# Altium schematic sheet 04-RS422-2.SchDoc
size A3
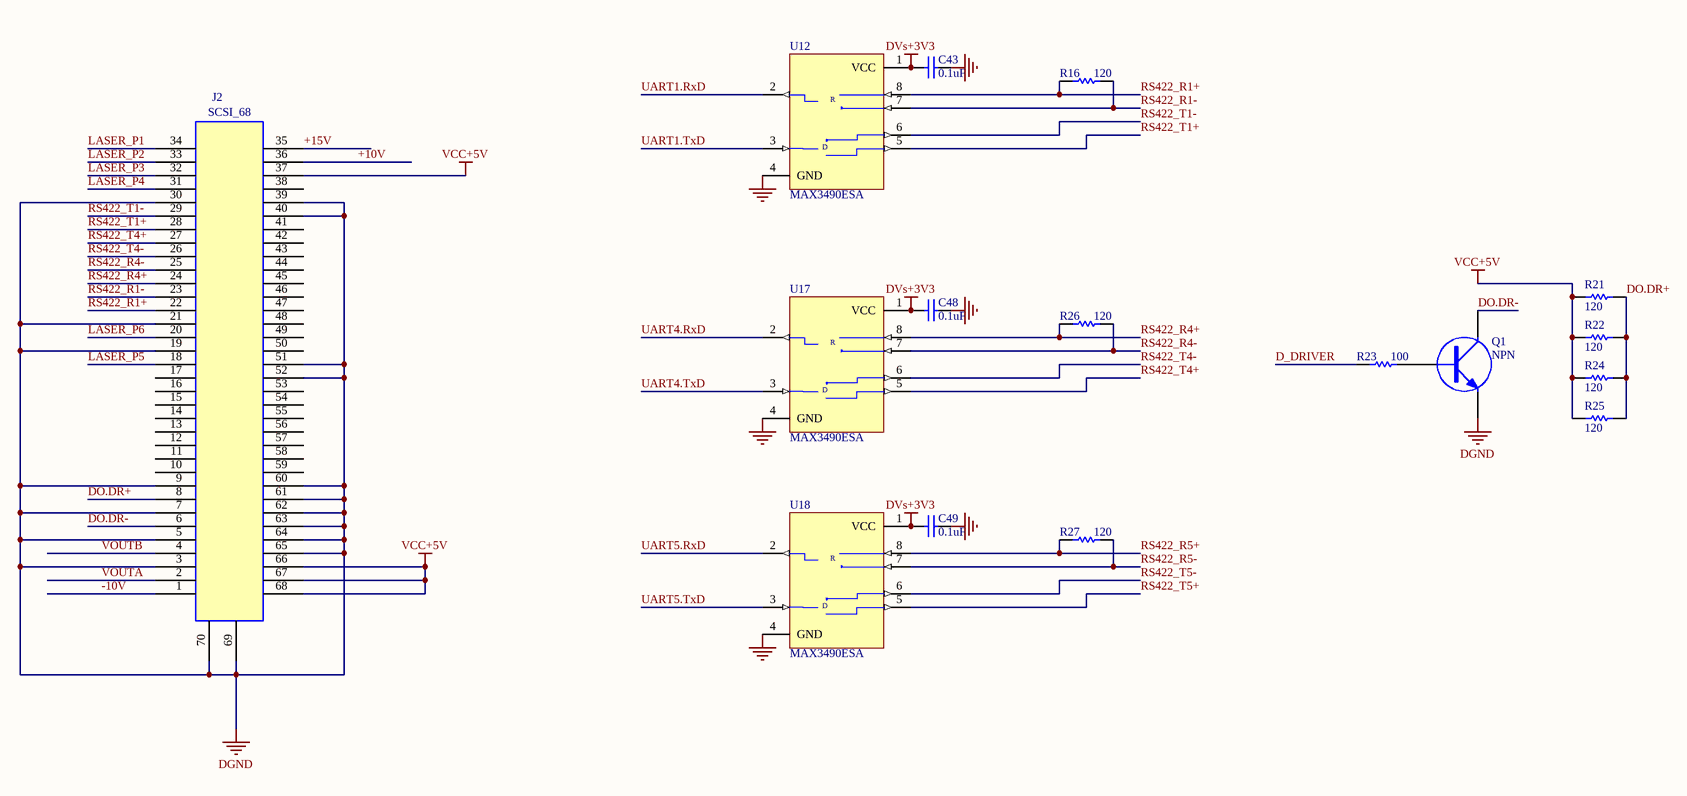
[diagram p0: 04-RS422-2.SchDoc]

## Parts
C43  0.1uF  [CR1608-0603]
C48  0.1uF  [CR1608-0603]
C49  0.1uF  [CR1608-0603]
J2  SCSI_68  [SCSI68]
Q1  NPN  [3DG130BJ_NPN]
R16  120  [CR3216-1206]
R21  120  [CR3216-1206]
R22  120  [CR3216-1206]
R23  100  [0805-X]
R24  120  [CR3216-1206]
R25  120  [CR3216-1206]
R26  120  [CR3216-1206]
R27  120  [CR3216-1206]
U12  MAX3490ESA  [SO8.W=6.0]
U17  MAX3490ESA  [SO8.W=6.0]
U18  MAX3490ESA  [SO8.W=6.0]

## Nets
DGND: C43.2 C48.2 C49.2 J2.3 J2.5 J2.7 J2.9 J2.19 J2.21 J2.30 J2.39 J2.40 J2.51 J2.52 J2.60 J2.61 J2.62 J2.63 J2.64 J2.65 J2.69 J2.70 Q1.3(E) U12.4(GND) U17.4(GND) U18.4(GND)
DVs+3V3: C43.1 C48.1 C49.1 U12.1(VCC) U17.1(VCC) U18.1(VCC)
VCC+5V: J2.37 J2.66 J2.67 J2.68 R21.1 R22.1 R24.1 R25.1
+10V: J2.36
+15V: J2.35
-10V: J2.1
D_DRIVER: R23.2
DO.DR+: J2.8 R21.2 R22.2 R24.2 R25.2
DO.DR-: J2.6 Q1.2(C)
LASER_P1: J2.34
LASER_P2: J2.33
LASER_P3: J2.32
LASER_P4: J2.31
LASER_P5: J2.18
LASER_P6: J2.20
RS422_R1+: J2.22 R16.2 U12.8(A)
RS422_R1-: J2.23 R16.1 U12.7(B)
RS422_R4+: J2.24 R26.2 U17.8(A)
RS422_R4-: J2.25 R26.1 U17.7(B)
RS422_R5+: R27.2 U18.8(A)
RS422_R5-: R27.1 U18.7(B)
RS422_T1+: J2.28 U12.5(Y)
RS422_T1-: J2.29 U12.6(Z)
RS422_T4+: J2.27 U17.5(Y)
RS422_T4-: J2.26 U17.6(Z)
RS422_T5+: U18.5(Y)
RS422_T5-: U18.6(Z)
UART1.RxD: U12.2(RO)
UART1.TxD: U12.3(DI)
UART4.RxD: U17.2(RO)
UART4.TxD: U17.3(DI)
UART5.RxD: U18.2(RO)
UART5.TxD: U18.3(DI)
VOUTA: J2.2
VOUTB: J2.4
NetQ1_1: Q1.1(B) R23.1

Not connected (* = marked no-connect by the designer): J2 10 11 12 13 14 15 16 17 38 41 42 43 44 45 46 47 48 49 50 53 54 55 56 57 58 59

## Notes on the sheet
- (in symbol MAX488ESA) R; D

## Library data of the parts
C43 C48 C49 = Cap: X7R; Published: 8-Jun-2000; LatestRevisionDate: 17-Jul-2002; LatestRevisionNote: Re-released for DXP Platform.; PackageReference: RAD-0.3; Publisher: Altium Limited; Value: 0.1uF
J2 = SCS
Q1 = NPN: NPN Transistor
R16 R21-R27 = Res1: Resistor; Published: 8-Jun-2000; LatestRevisionDate: 17-Jul-2002; LatestRevisionNote: Re-released for DXP Platform.; PackageReference: AXIAL-0.3; Publisher: Altium Limited
  R16 R21 R22 R24-R27: Value: 120
  R23: Value: 100
U12 U17 U18 = MAX488ESA: Low-Power, Slew-Rate-Limited RS-485/RS-422 Transceiver; Published: 16-Jan-2001; LatestRevisionDate: 13-Apr-2006; LatestRevisionNote: IPC-7351 Footprint Added.; DatasheetVersion: Feb-1996; PackageReference: NSO8; Publisher: Altium Limited; PackageDescription: 8-Pin Small Outline Integrated Circuit 1.27 mm Pitch; Code_JEDEC: MS-012-AA; Code_IPC: SOIC127P600-8; ComponentLink1Description: Manufacturer Link; ComponentLink1URL: http://www.maxim-ic.com/; ComponentLink2Description: Datasheet; ComponentLink2URL: http://pdfserv.maxim-ic.com/en/ds/MAX1487-MAX491.pdf